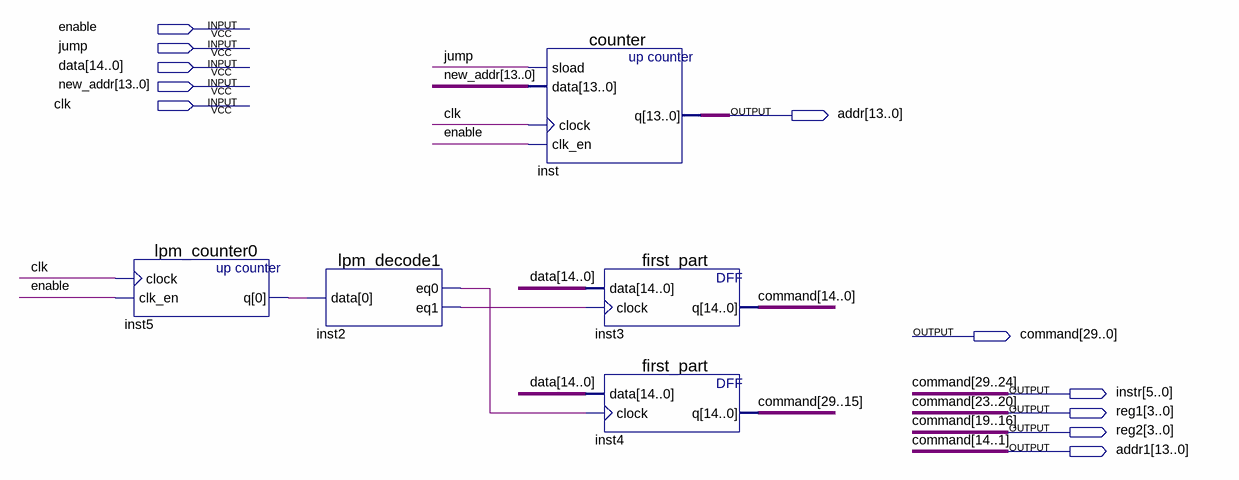
[diagram p0: schematic sheet]
// Quartus schematic ComRetr.bdf as structural Verilog: 5 symbols, 11 pins
module ComRetr (
  input  enable,
  input  jump,
  input  [14:0] data,
  input  [13:0] new_addr,
  input  clk,
  output [13:0] addr,
  output [29:0] command,
  output [5:0] instr,
  output [3:0] reg1,
  output [3:0] reg2,
  output [13:0] addr1
);

  wire inst2_eq0, inst2_eq1, inst5_q;

  lpm_counter0 inst5 (.clock(clk), .clk_en(enable), .q(inst5_q));
  lpm_decode1 inst2 (.data(inst5_q), .eq0(inst2_eq0), .eq1(inst2_eq1));
  counter inst (.sload(jump), .data(new_addr), .clock(clk), .clk_en(enable), .q(addr));
  first_part inst3 (.data(data), .clock(inst2_eq1), .q({addr1, command[0]}));
  first_part inst4 (.data(data), .clock(inst2_eq0), .q(command[29:15]));

  assign command[14:1] = addr1;
  assign instr = command[29:24];
  assign reg1 = command[23:20];
  assign reg2 = command[19:16];
endmodule
